# Altium schematic sheet RTC.SchDoc
size A4; SheetNumber: 6; SheetTotal: 9
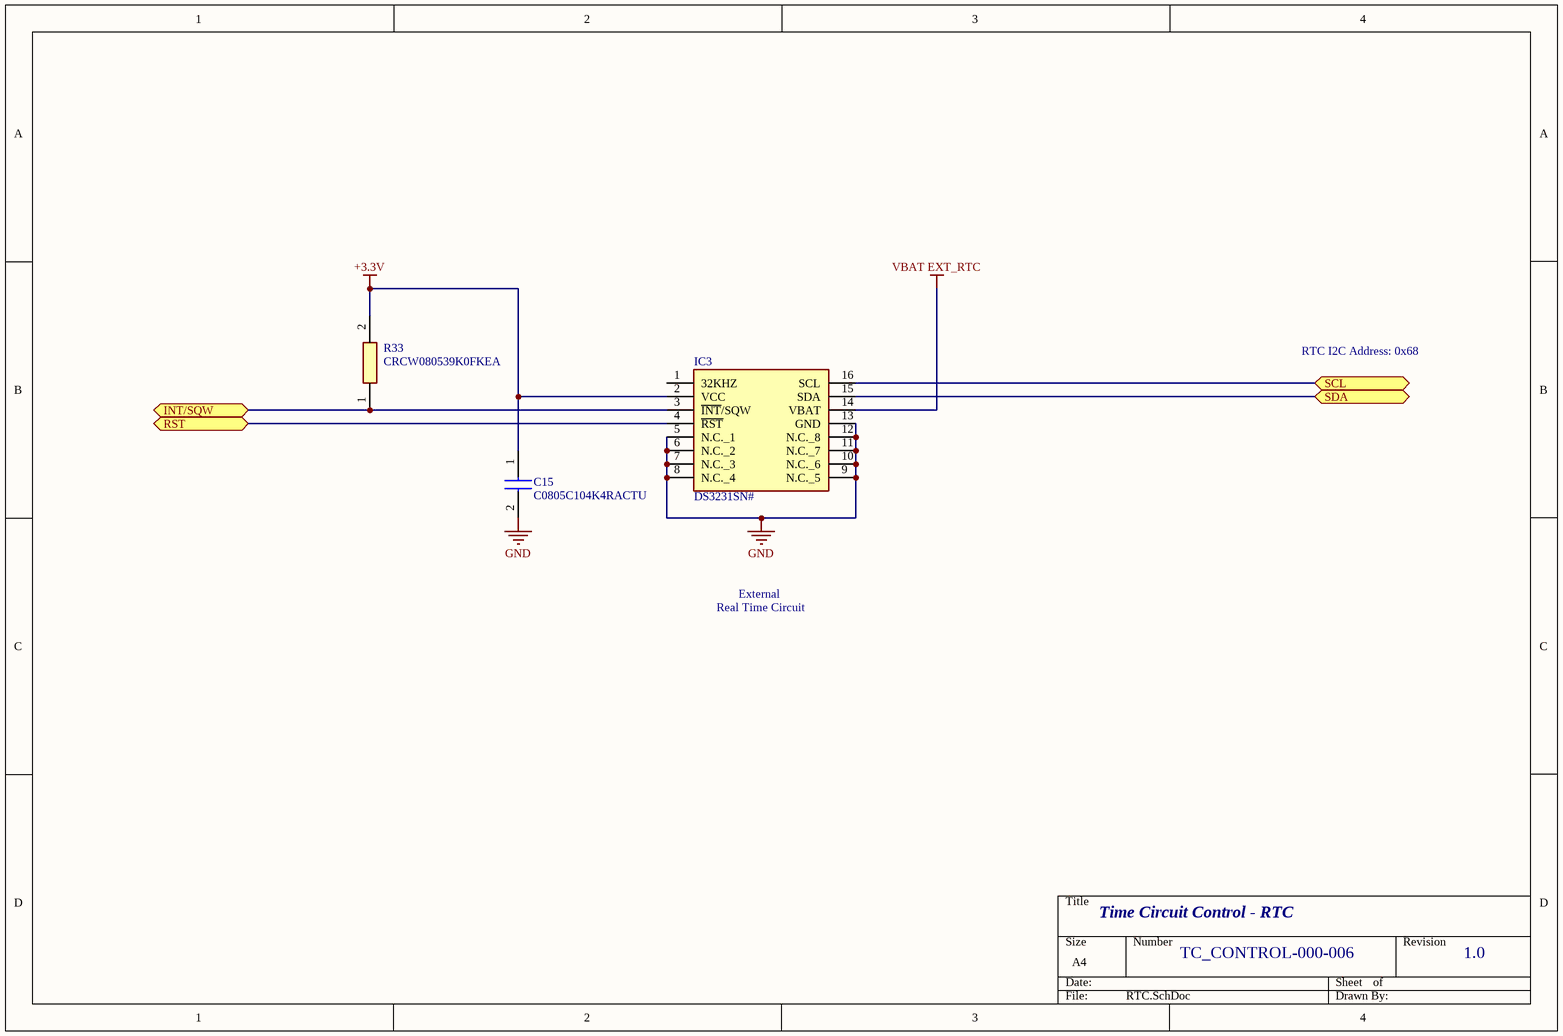
[diagram p0: RTC.SchDoc]

## Parts
C15  C0805C104K4RACTU  [CAPC2012X88N]
IC3  DS3231SN#  [SOIC127P1032X265-16N]
R33  CRCW080539K0FKEA  [RESC2012X50N]

## Ports
INT/SQW, RST, SCL, SDA

## Nets
+3.3V: C15.1 IC3.2(VCC) R33.2
GND: C15.2 IC3.5(N.C._1) IC3.6(N.C._2) IC3.7(N.C._3) IC3.8(N.C._4) IC3.9(N.C._5) IC3.10(N.C._6) IC3.11(N.C._7) IC3.12(N.C._8) IC3.13(GND)
VBAT EXT_RTC: IC3.14(VBAT)
INT/SQW: IC3.3(~{INT}/SQW) R33.1 ; port INT/SQW
RST: IC3.4(~{RST}) ; port RST
SCL: IC3.16(SCL) ; port SCL
SDA: IC3.15(SDA) ; port SDA

Not connected (* = marked no-connect by the designer): IC3 1(32KHZ)

## Notes on the sheet
- RTC I2C Address: 0x68
- External
  Real Time Circuit
- Time Circuit Control - RTC
- TC_CONTROL-000-006
- 1.0

## Library data of the parts
C15 = C0805C104K4RACTU: Capacitor; Manufacturer_Name: Kemet; Datasheet Link: http://docs-emea.rs-online.com/webdocs/134c/0900766b8134ce68.pdf; Height: 0.88mm; Manufacturer_Part_Number: C0805C104K4RACTU; Arrow Part Number: C0805C104K4RACTU; Arrow Price/Stock: https://www.arrow.com/en/products/c0805c104k4ractu/kemet-corporation; Mouser Part Number: 80-C0805C104K4R; Mouser Price/Stock: https://www.mouser.co.uk/ProductDetail/KEMET/C0805C104K4RACTU?qs=Pc30aiB8zWWfqQNJWggt%252BA%3D%3D
IC3 = DS3231SN#: Integrated Circuit; Manufacturer_Name: Maxim Integrated; Datasheet Link: https://datasheets.maximintegrated.com/en/ds/DS3231.pdf; Height: 2.65mm; Manufacturer_Part_Number: DS3231SN#; Mouser Part Number: 700-DS3231SN#; Mouser Price/Stock: https://www.mouser.co.uk/ProductDetail/Maxim-Integrated/DS3231SN?qs=1eQvB6Dk1vhUlr8%2FOrV0Fw%3D%3D; Arrow Part Number: DS3231SN#; Arrow Price/Stock: https://www.arrow.com/en/products/ds3231sn/maxim-integrated?region=nac
R33 = CRCW080539K0FKEA: Resistor; Manufacturer_Name: Vishay; Datasheet Link: http://www.vishay.com/docs/20035/dcrcwe3.pdf; Height: 0.5mm; Manufacturer_Part_Number: CRCW080539K0FKEA; Arrow Part Number: CRCW080539K0FKEA; Mouser Part Number: 71-CRCW080539K0FKEA; Mouser Price/Stock: https://www.mouser.co.uk/ProductDetail/Vishay-Dale/CRCW080539K0FKEA?qs=kJXytlGtIWlXWBq67QQPjA%3D%3D